# Altium schematic sheet Power_supply.SchDoc: Power supply
size A3; Author: Valentin Py; DrawnBy: Valentin Py; Engineer: Valentin Py; Address1: valentin.py@gmail.com; SheetNumber: 1; SheetTotal: 5; PageSetup: Record=PageOptions|CenterHorizontal=True|CenterVertical=True|PrintScale=0.24|XCorrection=1.00|YCorrection=1.00|PrintKind=0|BorderSize=5000000|LeftOffset=0|BottomOffset=0|Orientation=2|PaperLength=1000|PaperWidth=1000|Scale=100|PaperSource=7|PrintQuality=-4|MediaType=1|DitherType=10|PaperKind=A4|PrintScaleMode=1
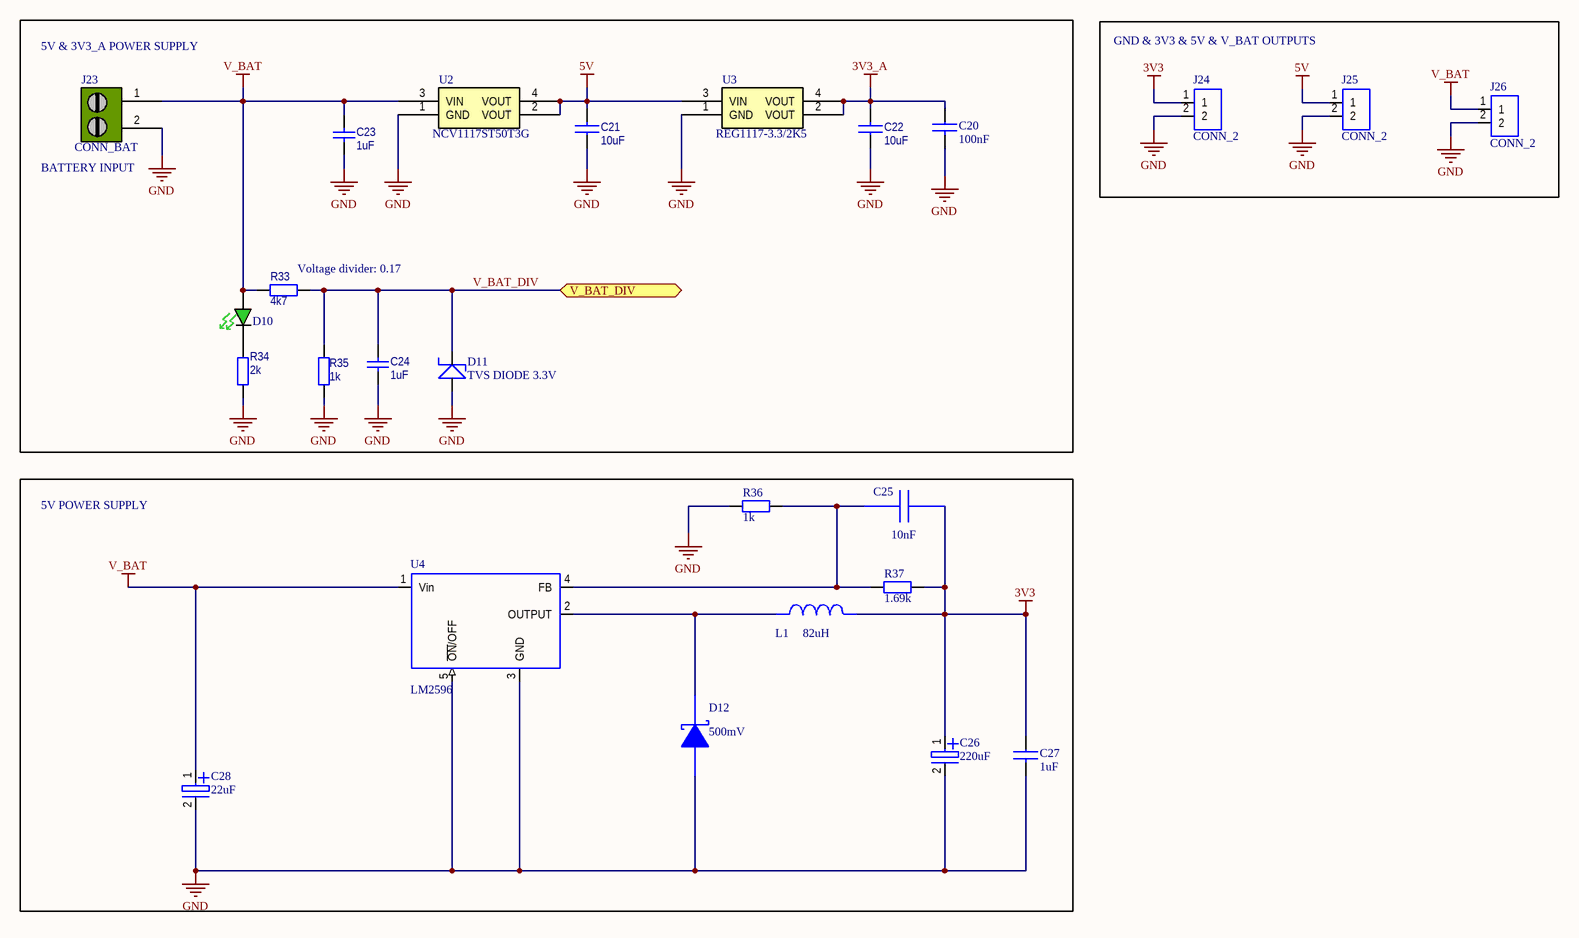
[diagram p0: Power_supply.SchDoc]

## Parts
C20  100nF  [080503]
C21  10uF  [080501]
C22  10uF  [080501]
C23  1uF  [080503]
C24  1uF  [080503]
C25  10nF  [080503]
C26  220uF  [1411]
C27  1uF  [080503]
C28  22uF  [2413]
D10  LED  [LED_0805 - GREEN]  (value not drawn)
D11  TVS DIODE 3.3V  [SOD-523]
D12  value 500mV  [SMA]  (hidden comment: B230A-13-F)
J23  CONN_BAT  [SL508_2C]
J24  CONN_2  [640454-2]
J25  CONN_2  [640454-2]
J26  CONN_2  [640454-2]
L1  82uH  [L1]
R33  4k7  [060301]
R34  2k  [060301]
R35  1k  [060301]
R36  1k  [060301]
R37  1.69k  [060301]
U2  NCV1117ST50T3G  [SOT223]
U3  REG1117-3.3/2K5  [SOT223]
U4  LM2596  [TO263]

## Blocks framed on the sheet
GND & 3V3 & 5V & V_BAT OUTPUTS: J24-J26
5V POWER SUPPLY: C25-C28 D12 L1 R36 R37 U4

## Ports
V_BAT_DIV

## Nets
3V3: C25.1 C26.1 C27.1 J24.1 L1.2 R37.2
3V3_A: C20.1 C22.2 U3.2(VOUT) U3.4(VOUT)
5V: C21.2 J25.1 U2.2(VOUT) U2.4(VOUT) U3.3(VIN)
GND: C20.2 C21.1 C22.1 C23.2 C24.2 C26.2 C27.2 C28.2 D11.1 D12.2(A) J23.2 J24.2 J25.2 J26.2 R34.1 R35.2 R36.1 U2.1(GND) U3.1(GND) U4.3(GND) U4.5(~{ON}/OFF)
V_BAT: C23.1 C28.1 D10.A J23.1 J26.1 R33.2 U2.3(VIN) U4.1(Vin)
V_BAT_DIV: C24.1 D11.2 R33.1 R35.1 ; port V_BAT_DIV
NetC25_2: C25.2 R36.2 R37.1 U4.4(FB)
NetD10_C: D10.C R34.2
NetD12_1: D12.1(K) L1.1 U4.2(OUTPUT)

## Notes on the sheet
- (near J23) 5V & 3V3_A POWER SUPPLY
- (near J23) BATTERY INPUT
- (near R33) Voltage divider: 0.17
- Title
- Size:
- Date:
- A3
- Author:
- Time:
- Revision:
- Sheet
- of
- File:

## Library data of the parts
C20 = CAPA: CAP CER 0.1UF 25V 10% X7R 0805; Value: 100nF; Supplier 1: Digi-Key; Supplier Part Number 1: 1276-1099-1-ND
C21 C22 = CAPA: CAP CER 10UF 16V 20% X6S 0805; Value: 10uF; Supplier 1: Digi-Key; Supplier Part Number 1: 445-7612-1-ND
C23 C24 = Cap Semi: CAP CER 1UF 25V 10% X7R 0805; Value: 1uF; Supplier 1: Digi-Key; Supplier Part Number 1: 399-1168-1-ND
C25 = GRM216R71H103KA01D: CAP CER 10nF 50V 10% X7R 0805; Value: 10nF; Supplier 1: Digi-Key; Supplier Part Number 1: 399-1158-1-ND
C26 = CAPA_EL: CAP TANT 220UF 4V 20% 1411; Value: 220uF; Supplier 1: Digi-Key; Supplier Part Number 1: 399-4625-6-ND
C27 = CAPA: CAP CER 1UF 25V 10% X7R 0805; Value: 1uF; Supplier 1: Digi-Key; Supplier Part Number 1: 399-1168-1-ND
C28 = CAPA_EL: CAP TANT 22UF 25V 10% 2413; Value: 22uF; Supplier 1: Digi-Key; Supplier Part Number 1: 399-3746-1-ND
D10 = APT2012CGCK: LED 2X1.2MM 570NM GN WTR CLR SMD; Supplier 1: Digi-Key; Supplier Part Number 1: 754-1127-1-ND
D11 = Zener: TVS DIODE 3.3VWM 8VC SOD523; Supplier 1: Digi-Key; Supplier Part Number 1: 641-1395-1-ND
J23 = 282857-2: TERM BLOCK HDR 2POS R/A 5.08MM; Supplier 1: Digi-Key; Supplier Part Number 1: 281-1279-ND; Value: 282857-2
J24-J26 = CONN_2: CONN HEADER 2.54mm 2; Supplier 1: Stock
L1 = SDR1307-820KL: Value: 82uH; Supplier 1: Digi-Key; Supplier Part Number 1: SDR1307-820KLCT-ND
R33 = RES: RES 4.7K 1% 0603; Value: 4k7; Supplier 1: Digi-Key; Supplier Part Number 1: RMCF0603FT4K70CT-ND
R34 = RES: RES 2K 1% 0805; Value: 2k; Supplier 1: Digi-Key; Supplier Part Number 1: P2.00KHCT-ND
R35 R36 = RES: RES 1k 0805; Value: 1k; Supplier 1: Digi-Key
  R35: Supplier Part Number 1: P1.00KHDKR-ND
R37 = RES: RES 1.69K OHM 1% 1/8W 0805; Value: 1.69k; Supplier 1: Digi-Key; Supplier Part Number 1: P1.69KHCT-ND
U2 = NCV1117ST50T3G: Low Dropout (LDO) Regulators ANA 800mA LDO; Supplier 1: Digi-Key; Supplier Part Number 1: NCV1117ST50T3GOSCT-ND
U3 = NCV1117ST50T3G: IC REG LDO 3.3V 0.8A SOT223; Supplier 1: Digi-Key; Supplier Part Number 1: 296-21321-1-ND
U4 = LM2596: IC REG BUCK ADJ 3A TO263-5; Supplier 1: Digi-Key; Supplier Part Number 1: 296-35399-1-ND
D12 = B230A-13-F: Supplier 1: Digi-Key; Supplier Part Number 1: B230A-FDICT-ND